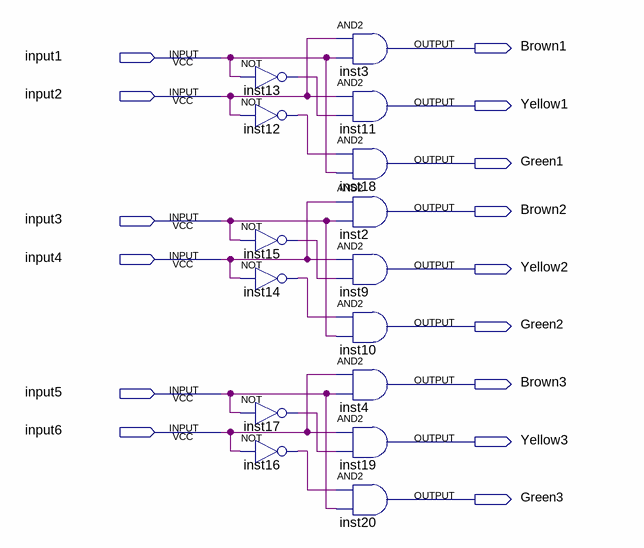
[diagram p0: schematic sheet]
// Quartus schematic recipie_out.bdf as structural Verilog: 15 symbols, 15 pins
module recipie_out (
  input  input1,
  input  input2,
  input  input3,
  input  input4,
  input  input5,
  input  input6,
  output Brown1,
  output Yellow1,
  output Green1,
  output Brown2,
  output Yellow2,
  output Green2,
  output Brown3,
  output Yellow3,
  output Green3
);

  wire inst12_out, inst13_out, inst14_out, inst15_out, inst16_out, inst17_out;

  not inst13 (inst13_out, input1);
  not inst12 (inst12_out, input2);
  not inst15 (inst15_out, input3);
  not inst14 (inst14_out, input4);
  not inst17 (inst17_out, input5);
  not inst16 (inst16_out, input6);
  and inst3 (Brown1, input2, input1);
  and inst11 (Yellow1, input2, inst13_out);
  and inst18 (Green1, inst12_out, input1);
  and inst2 (Brown2, input4, input3);
  and inst9 (Yellow2, input4, inst15_out);
  and inst10 (Green2, inst14_out, input3);
  and inst4 (Brown3, input6, input5);
  and inst19 (Yellow3, input6, inst17_out);
  and inst20 (Green3, inst16_out, input5);
endmodule
